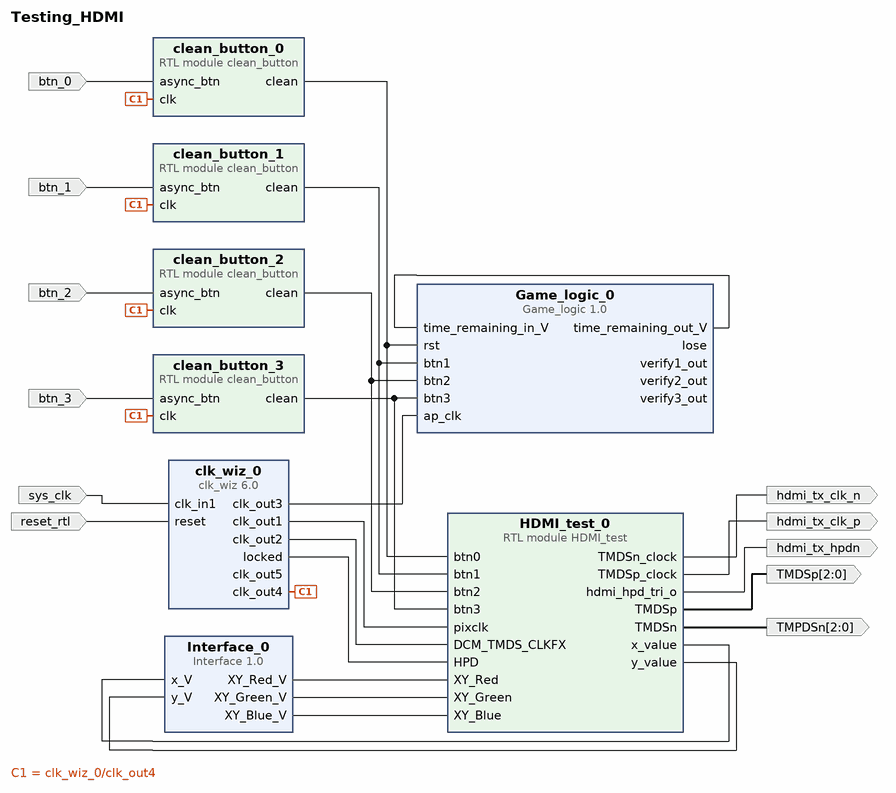
[diagram p0: block diagram of the top level]
# Vivado block design Testing_HDMI, xc7z020clg400-1, Vivado 2018.3
create_bd_design Testing_HDMI

create_bd_port -dir I sys_clk
create_bd_port -dir O -from 2 -to 0 TMDSp
create_bd_port -dir O -from 2 -to 0 TMPDSn
create_bd_port -dir I btn_0
create_bd_port -dir I btn_1
create_bd_port -dir I btn_2
create_bd_port -dir I -type rst reset_rtl
set_property -dict {CONFIG.POLARITY ACTIVE_HIGH} [get_bd_ports reset_rtl]
create_bd_port -dir I btn_3
create_bd_port -dir O hdmi_tx_hpdn
create_bd_port -dir O hdmi_tx_clk_p
create_bd_port -dir O hdmi_tx_clk_n

create_bd_cell -type ip -vlnv xilinx.com:ip:clk_wiz:6.0 clk_wiz_0
set_property -dict [list \
  CONFIG.CLKIN1_JITTER_PS 80.0 \
  CONFIG.CLKOUT1_JITTER 179.952 \
  CONFIG.CLKOUT1_PHASE_ERROR 112.379 \
  CONFIG.CLKOUT1_REQUESTED_OUT_FREQ 25 \
  CONFIG.CLKOUT1_USED true \
  CONFIG.CLKOUT2_JITTER 112.962 \
  CONFIG.CLKOUT2_PHASE_ERROR 112.379 \
  CONFIG.CLKOUT2_REQUESTED_OUT_FREQ 250 \
  CONFIG.CLKOUT2_USED true \
  CONFIG.CLKOUT3_JITTER 136.634 \
  CONFIG.CLKOUT3_PHASE_ERROR 112.379 \
  CONFIG.CLKOUT3_USED true \
  CONFIG.CLKOUT4_JITTER 193.392 \
  CONFIG.CLKOUT4_PHASE_ERROR 112.379 \
  CONFIG.CLKOUT4_REQUESTED_OUT_FREQ 16.6666 \
  CONFIG.CLKOUT4_USED true \
  CONFIG.CLKOUT5_JITTER 237.289 \
  CONFIG.CLKOUT5_PHASE_ERROR 112.379 \
  CONFIG.CLKOUT5_REQUESTED_OUT_FREQ 5 \
  CONFIG.CLKOUT5_USED true \
  CONFIG.MMCM_CLKFBOUT_MULT_F 6.000 \
  CONFIG.MMCM_CLKIN1_PERIOD 8.000 \
  CONFIG.MMCM_CLKIN2_PERIOD 10.0 \
  CONFIG.MMCM_CLKOUT0_DIVIDE_F 31.250 \
  CONFIG.MMCM_CLKOUT1_DIVIDE 3 \
  CONFIG.MMCM_CLKOUT2_DIVIDE 8 \
  CONFIG.MMCM_CLKOUT3_DIVIDE 45 \
  CONFIG.MMCM_CLKOUT4_DIVIDE 128 \
  CONFIG.MMCM_DIVCLK_DIVIDE 1 \
  CONFIG.NUM_OUT_CLKS 5 \
  CONFIG.PRIM_IN_FREQ 125 \
] [get_bd_cells clk_wiz_0]
create_bd_cell -type module -reference clean_button clean_button_0
create_bd_cell -type module -reference clean_button clean_button_1
create_bd_cell -type module -reference clean_button clean_button_2
create_bd_cell -type module -reference clean_button clean_button_3
create_bd_cell -type module -reference HDMI_test HDMI_test_0
create_bd_cell -type ip -vlnv xilinx.com:hls:Game_logic:1.0 Game_logic_0
create_bd_cell -type ip -vlnv xilinx.com:hls:Interface:1.0 Interface_0

# ---- connections ----

connect_bd_net [get_bd_ports sys_clk] [get_bd_pins clk_wiz_0/clk_in1]
connect_bd_net [get_bd_pins HDMI_test_0/TMDSp] [get_bd_ports TMDSp]
connect_bd_net [get_bd_pins HDMI_test_0/TMDSn] [get_bd_ports TMPDSn]
connect_bd_net [get_bd_pins clk_wiz_0/clk_out1] [get_bd_pins HDMI_test_0/pixclk]
connect_bd_net [get_bd_pins clk_wiz_0/clk_out2] [get_bd_pins HDMI_test_0/DCM_TMDS_CLKFX]
connect_bd_net [get_bd_pins clk_wiz_0/locked] [get_bd_pins HDMI_test_0/HPD]
connect_bd_net [get_bd_ports reset_rtl] [get_bd_pins clk_wiz_0/reset]
connect_bd_net [get_bd_pins HDMI_test_0/hdmi_hpd_tri_o] [get_bd_ports hdmi_tx_hpdn]
connect_bd_net [get_bd_pins HDMI_test_0/TMDSp_clock] [get_bd_ports hdmi_tx_clk_p]
connect_bd_net [get_bd_pins HDMI_test_0/TMDSn_clock] [get_bd_ports hdmi_tx_clk_n]
connect_bd_net [get_bd_pins clk_wiz_0/clk_out4] \
  [get_bd_pins clean_button_0/clk] [get_bd_pins clean_button_1/clk] [get_bd_pins clean_button_2/clk] \
  [get_bd_pins clean_button_3/clk]
connect_bd_net -net btn_0_1 [get_bd_ports btn_0] [get_bd_pins clean_button_0/async_btn]
connect_bd_net -net btn_1_1 [get_bd_ports btn_1] [get_bd_pins clean_button_1/async_btn]
connect_bd_net -net btn_2_1 [get_bd_ports btn_2] [get_bd_pins clean_button_2/async_btn]
connect_bd_net -net btn_3_1 [get_bd_ports btn_3] [get_bd_pins clean_button_3/async_btn]
connect_bd_net [get_bd_pins clean_button_0/clean] [get_bd_pins HDMI_test_0/btn0] [get_bd_pins Game_logic_0/rst]
connect_bd_net [get_bd_pins clean_button_1/clean] [get_bd_pins HDMI_test_0/btn1] [get_bd_pins Game_logic_0/btn1]
connect_bd_net [get_bd_pins clean_button_2/clean] [get_bd_pins HDMI_test_0/btn2] [get_bd_pins Game_logic_0/btn2]
connect_bd_net [get_bd_pins clean_button_3/clean] [get_bd_pins HDMI_test_0/btn3] [get_bd_pins Game_logic_0/btn3]
connect_bd_net [get_bd_pins HDMI_test_0/x_value] [get_bd_pins Interface_0/x_V]
connect_bd_net [get_bd_pins HDMI_test_0/y_value] [get_bd_pins Interface_0/y_V]
connect_bd_net [get_bd_pins Interface_0/XY_Red_V] [get_bd_pins HDMI_test_0/XY_Red]
connect_bd_net [get_bd_pins Interface_0/XY_Green_V] [get_bd_pins HDMI_test_0/XY_Green]
connect_bd_net [get_bd_pins Interface_0/XY_Blue_V] [get_bd_pins HDMI_test_0/XY_Blue]
# net clk_wiz_0_clk_out5 has one end: clk_wiz_0/clk_out5
# net Game_logic_0_lose has one end: Game_logic_0/lose
connect_bd_net [get_bd_pins Game_logic_0/time_remaining_out_V] [get_bd_pins Game_logic_0/time_remaining_in_V]
# net Game_logic_0_verify1_out has one end: Game_logic_0/verify1_out
# net Game_logic_0_verify2_out has one end: Game_logic_0/verify2_out
# net Game_logic_0_verify3_out has one end: Game_logic_0/verify3_out
connect_bd_net [get_bd_pins clk_wiz_0/clk_out3] [get_bd_pins Game_logic_0/ap_clk]

validate_bd_design
save_bd_design
